# EAGLE design rf_blinky (EAGLE 5.11)

## Sheet 1 of 3
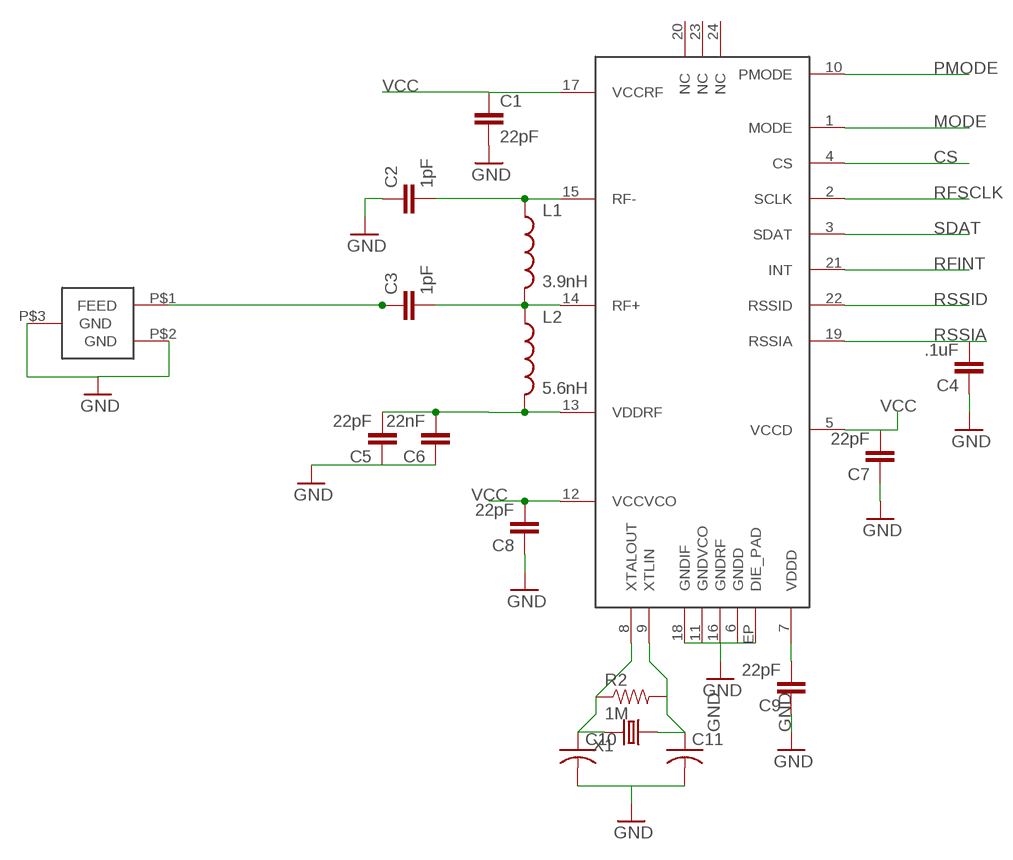
[diagram p0: schematic, sheet 1]

### Parts
ANT1  ANT_W3008  [W3008]
C1  22pF  CAP0603-CAP  [0603-CAP]
C2  1pF  CAP0603-CAP  [0603-CAP]
C3  1pF  CAP0603-CAP  [0603-CAP]
C4  .1uF  CAP0603-CAP  [0603-CAP]
C5  22pF  CAP0603-CAP  [0603-CAP]
C6  22nF  CAP0603-CAP  [0603-CAP]
C7  22pF  CAP0603-CAP  [0603-CAP]
C8  22pF  CAP0603-CAP  [0603-CAP]
C9  22pF  CAP0603-CAP  [0603-CAP]
C10  C-USC0805  [C0805]
C11  C-USC0805  [C0805]
IC3  TRC104  [QFN24]
L1  3.9nH  INDUCTOR0603  [0603]
L2  5.6nH  INDUCTOR0603  [0603]
R2  1M  RESISTOR0603-RES  [0603-RES]
X1  CRYSTAL-5032  [5032]

### Nets
ANT: ANT1.P$1(FEED) C3.1
CS: IC3.4(CS) ; also sheet 2
GND: ANT1.P$2(GND) ANT1.P$3(GND) C1.2 C2.1 C4.1 C5.1 C6.1 C7.1 C8.1 C9.1 C10.2 C11.2 IC3.6(GNDD) IC3.11(GNDVCO) IC3.16(GNDRF) IC3.18(GNDIF) IC3.EP(DIE_PAD) ; also sheet 2
MODE: IC3.1(MODE) ; also sheet 2
N$1: C5.2 C6.2 IC3.13(VDDRF) L2.2
N$2: C9.2 IC3.7(VDDD)
N$3: C3.2 IC3.14(RF+) L1.2 L2.1
N$4: C2.2 IC3.15(RF-) L1.1
N$7: C10.1 IC3.8(XTALOUT) R2.1 X1.2
N$8: C11.1 IC3.9(XTLIN) R2.2 X1.1
PMODE: IC3.10(PMODE) ; also sheet 2
RFINT: IC3.21(INT) ; also sheet 2
RFSCLK: IC3.2(SCLK) ; also sheet 2
RSSIA: C4.2 IC3.19(RSSIA) ; also sheet 2
RSSID: IC3.22(RSSID) ; also sheet 2
SDAT: IC3.3(SDAT) ; also sheet 2
VCC: C1.1 C7.2 C8.2 IC3.5(VCCD) IC3.12(VCCVCO) IC3.17(VCCRF) ; also sheet 2,3
Unconnected: IC3.20(NC) IC3.23(NC) IC3.24(NC)

## Sheet 2 of 3
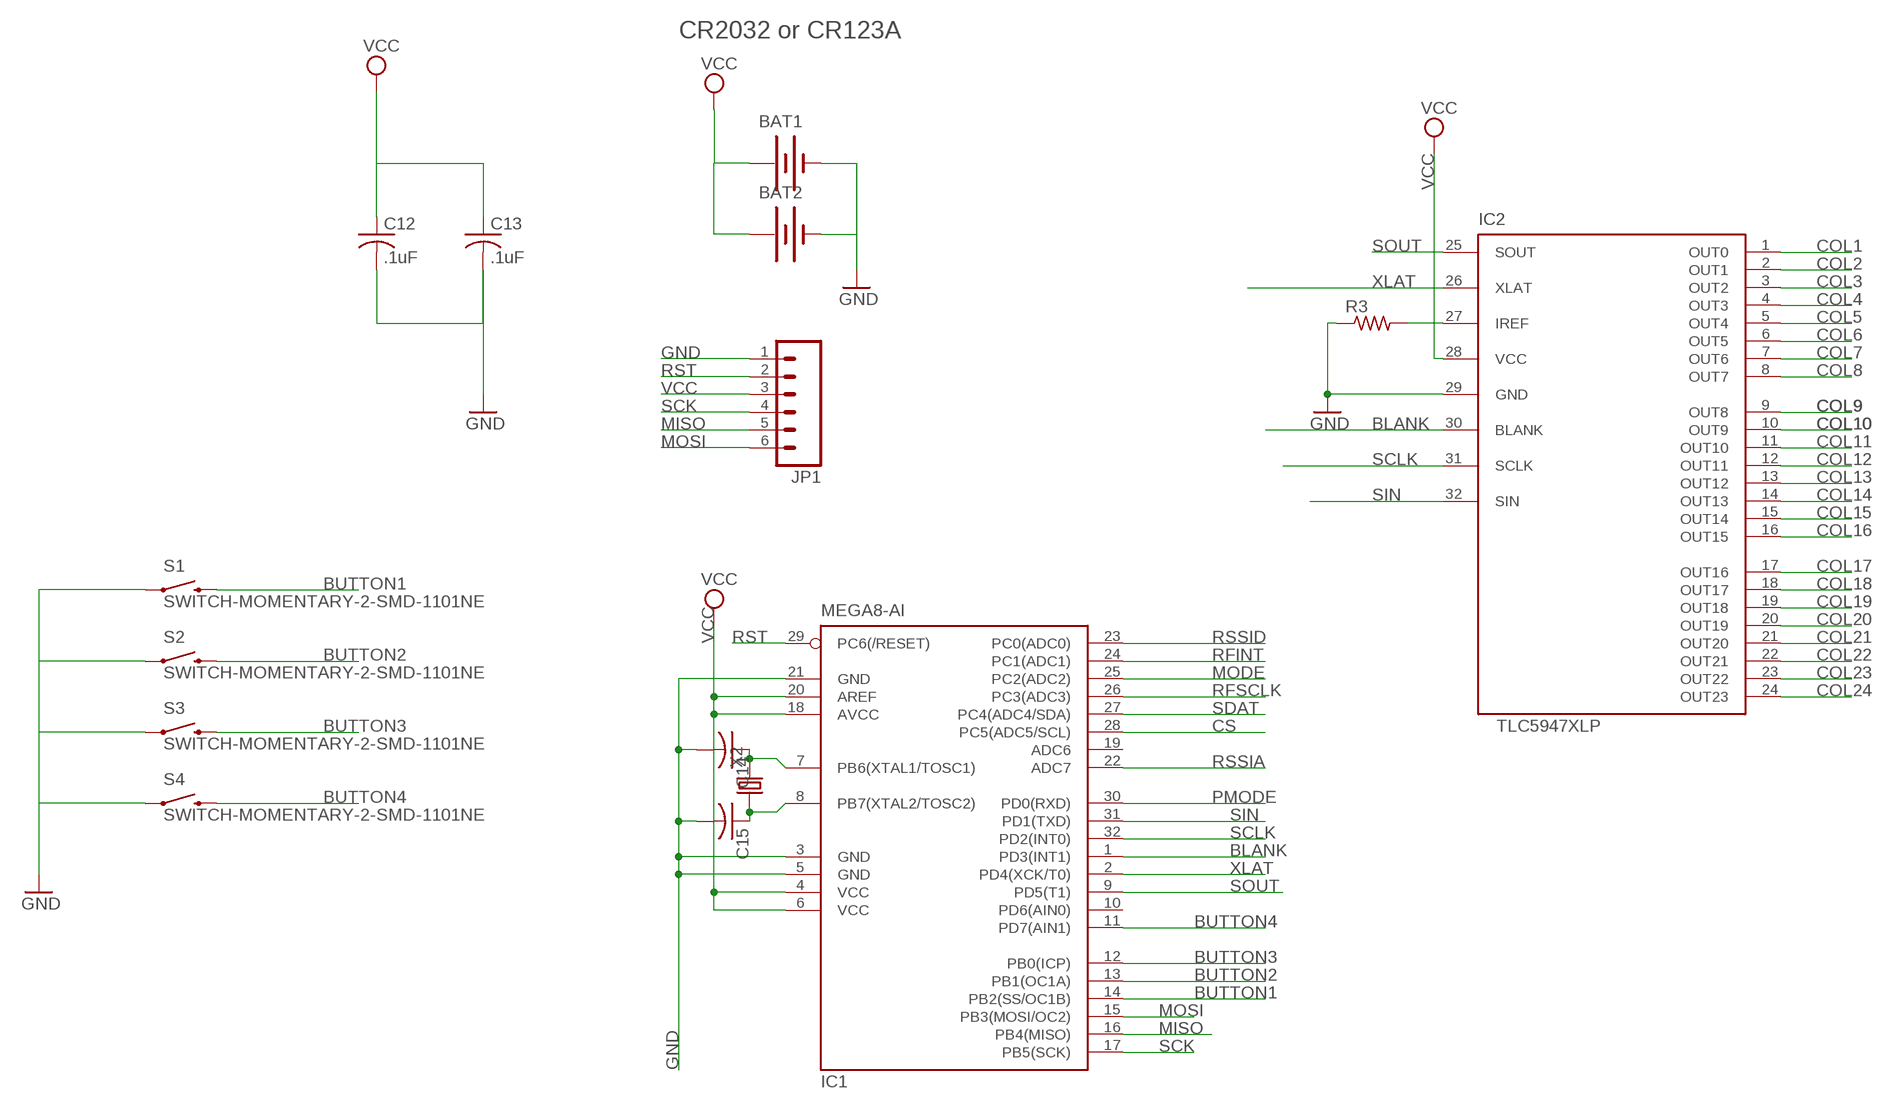
[diagram p1: schematic, sheet 2]

### Parts
BAT1  BATTERY20SMD  [BATTCON_20MM]
BAT2  BATTERYCR123A  [BATTERY_CR123A]
C12  .1uF  C-USC0805  [C0805]
C13  .1uF  C-USC0805  [C0805]
C14  C-USC0805  [C0805]
C15  C-USC0805  [C0805]
IC1  MEGA8-AI  [TQFP32-08]
IC2  TLC5947XLP  [QFN32_XLP]
JP1  M06SMD-FEMALE-V2  [1X06-SMD-FEMALE-V2]
R3  R-US_R1206  [R1206]
S1  SWITCH-MOMENTARY-2-SMD-1101NE  [TACTILE-SWITCH-1101NE]
S2  SWITCH-MOMENTARY-2-SMD-1101NE  [TACTILE-SWITCH-1101NE]
S3  SWITCH-MOMENTARY-2-SMD-1101NE  [TACTILE-SWITCH-1101NE]
S4  SWITCH-MOMENTARY-2-SMD-1101NE  [TACTILE-SWITCH-1101NE]
X2  CRYSTAL-5032  [5032]

### Nets
BLANK: IC1.1(PD3(INT1)) IC2.30(BLANK)
BUTTON1: IC1.14(PB2(SS/OC1B)) S1.P$2
BUTTON2: IC1.13(PB1(OC1A)) S2.P$2
BUTTON3: IC1.12(PB0(ICP)) S3.P$2
BUTTON4: IC1.11(PD7(AIN1)) S4.P$2
COL1: IC2.1(OUT0) ; also sheet 3
COL2: IC2.2(OUT1) ; also sheet 3
COL3: IC2.3(OUT2) ; also sheet 3
COL4: IC2.4(OUT3) ; also sheet 3
COL5: IC2.5(OUT4) ; also sheet 3
COL6: IC2.6(OUT5) ; also sheet 3
COL7: IC2.7(OUT6) ; also sheet 3
COL8: IC2.8(OUT7) ; also sheet 3
COL9: IC2.9(OUT8) ; also sheet 3
COL10: IC2.10(OUT9) ; also sheet 3
COL11: IC2.11(OUT10) ; also sheet 3
COL12: IC2.12(OUT11) ; also sheet 3
COL13: IC2.13(OUT12) ; also sheet 3
COL14: IC2.14(OUT13) ; also sheet 3
COL15: IC2.15(OUT14) ; also sheet 3
COL16: IC2.16(OUT15) ; also sheet 3
COL17: IC2.17(OUT16) ; also sheet 3
COL18: IC2.18(OUT17) ; also sheet 3
COL19: IC2.19(OUT18) ; also sheet 3
COL20: IC2.20(OUT19) ; also sheet 3
COL21: IC2.21(OUT20) ; also sheet 3
COL22: IC2.22(OUT21) ; also sheet 3
COL23: IC2.23(OUT22) ; also sheet 3
COL24: IC2.24(OUT23) ; also sheet 3
CS: IC1.28(PC5(ADC5/SCL)) ; also sheet 1
GND: BAT1.2(-) BAT2.- C12.2 C13.2 C14.2 C15.2 IC1.3(GND) IC1.5(GND) IC1.21(GND) IC2.29(GND) JP1.1 R3.1 S1.P$1 S2.P$1 S3.P$1 S4.P$1 ; also sheet 1
MISO: IC1.16(PB4(MISO)) JP1.5
MODE: IC1.25(PC2(ADC2)) ; also sheet 1
MOSI: IC1.15(PB3(MOSI/OC2)) JP1.6
N$5: C15.1 IC1.8(PB7(XTAL2/TOSC2)) X2.1
N$6: C14.1 IC1.7(PB6(XTAL1/TOSC1)) X2.2
N$13: IC2.27(IREF) R3.2
PMODE: IC1.30(PD0(RXD)) ; also sheet 1
RFINT: IC1.24(PC1(ADC1)) ; also sheet 1
RFSCLK: IC1.26(PC3(ADC3)) ; also sheet 1
RSSIA: IC1.22(ADC7) ; also sheet 1
RSSID: IC1.23(PC0(ADC0)) ; also sheet 1
RST: IC1.29(PC6(/RESET)) JP1.2
SCK: IC1.17(PB5(SCK)) JP1.4
SCLK: IC1.32(PD2(INT0)) IC2.31(SCLK)
SDAT: IC1.27(PC4(ADC4/SDA)) ; also sheet 1
SIN: IC1.31(PD1(TXD)) IC2.32(SIN)
SOUT: IC1.9(PD5(T1)) IC2.25(SOUT)
VCC: BAT1.1(+) BAT2.+ C12.1 C13.1 IC1.4(VCC) IC1.6(VCC) IC1.18(AVCC) IC1.20(AREF) IC2.28(VCC) JP1.3 ; also sheet 1,3
XLAT: IC1.2(PD4(XCK/T0)) IC2.26(XLAT)
Unconnected: IC1.10(PD6(AIN0)) IC1.19(ADC6)

### Notes on the sheet
- CR2032 or CR123A

## Sheet 3 of 3
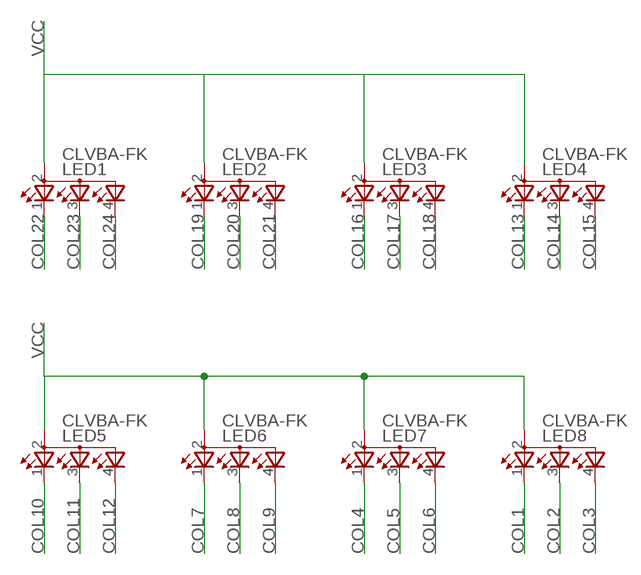
[diagram p2: schematic, sheet 3]

### Parts
LED1  CLVBA-FK  [PLCC4]
LED2  CLVBA-FK  [PLCC4]
LED3  CLVBA-FK  [PLCC4]
LED4  CLVBA-FK  [PLCC4]
LED5  CLVBA-FK  [PLCC4]
LED6  CLVBA-FK  [PLCC4]
LED7  CLVBA-FK  [PLCC4]
LED8  CLVBA-FK  [PLCC4]

### Nets
COL1: LED8.1(CRED) ; also sheet 2
COL2: LED8.3(CBLUE) ; also sheet 2
COL3: LED8.4(CGREEN) ; also sheet 2
COL4: LED7.1(CRED) ; also sheet 2
COL5: LED7.3(CBLUE) ; also sheet 2
COL6: LED7.4(CGREEN) ; also sheet 2
COL7: LED6.1(CRED) ; also sheet 2
COL8: LED6.3(CBLUE) ; also sheet 2
COL9: LED6.4(CGREEN) ; also sheet 2
COL10: LED5.1(CRED) ; also sheet 2
COL11: LED5.3(CBLUE) ; also sheet 2
COL12: LED5.4(CGREEN) ; also sheet 2
COL13: LED4.1(CRED) ; also sheet 2
COL14: LED4.3(CBLUE) ; also sheet 2
COL15: LED4.4(CGREEN) ; also sheet 2
COL16: LED3.1(CRED) ; also sheet 2
COL17: LED3.3(CBLUE) ; also sheet 2
COL18: LED3.4(CGREEN) ; also sheet 2
COL19: LED2.1(CRED) ; also sheet 2
COL20: LED2.3(CBLUE) ; also sheet 2
COL21: LED2.4(CGREEN) ; also sheet 2
COL22: LED1.1(CRED) ; also sheet 2
COL23: LED1.3(CBLUE) ; also sheet 2
COL24: LED1.4(CGREEN) ; also sheet 2
VCC: LED1.2(A2) LED2.2(A2) LED3.2(A2) LED4.2(A2) LED5.2(A2) LED6.2(A2) LED7.2(A2) LED8.2(A2) ; also sheet 1,2

## Library data of the parts
ANT1 = rf_blinky:ANT_W3008
BAT1 = SparkFun:BATTERY: Battery Holders Various common sizes : AA, AAA, 20mm coin cell and 12mm coin cell.
BAT2 = 8x8:BATTERY: Battery Holders Various common sizes : AA, AAA, 20mm coin cell and 12mm coin cell.
C1-C9 = SparkFun:CAP: Capacitor Standard 0603 ceramic capacitor, and 0.1" leaded capacitor.
C10-C15 = rcl:C-US: CAPACITOR, American symbol
IC1 = atmel:MEGA8: MICROCONTROLLER 8 Kbytes FLASH, 1 kbytes SRAM, 512 bytes EEPROM, USART, 6-channel 10 bit ADC, 2-channel 8 bit ADC Pin compatible with Atmega48, ATMega88, ATMega168 Source: avr.lbr; MPN: ATMEGA8-16AU; OC_FARNELL: 9171371; OC_NEWARK: 73M8863
IC2 = slice_noshift:TLC5947
IC3 = rf_blinky:TRC104
JP1 = 8x8:M06
L1 L2 = SparkFun:INDUCTOR: Inductors Basic Inductor/Choke - 0603 and 1206. Footprints are not proven and vary greatly between part numbers.
LED1-LED8 = rf_blinky:CLVBA-FK
R2 = SparkFun:RESISTOR: Resistor Basic schematic elements and footprints for 0603, 1206, and PTH resistors.
R3 = rcl:R-US_: RESISTOR, American symbol
S1-S4 = CPLD_Class:SWITCH-MOMENTARY-2
X1 X2 = NSL_MiniQuad:CRYSTAL*: CRYSTAL

## Board
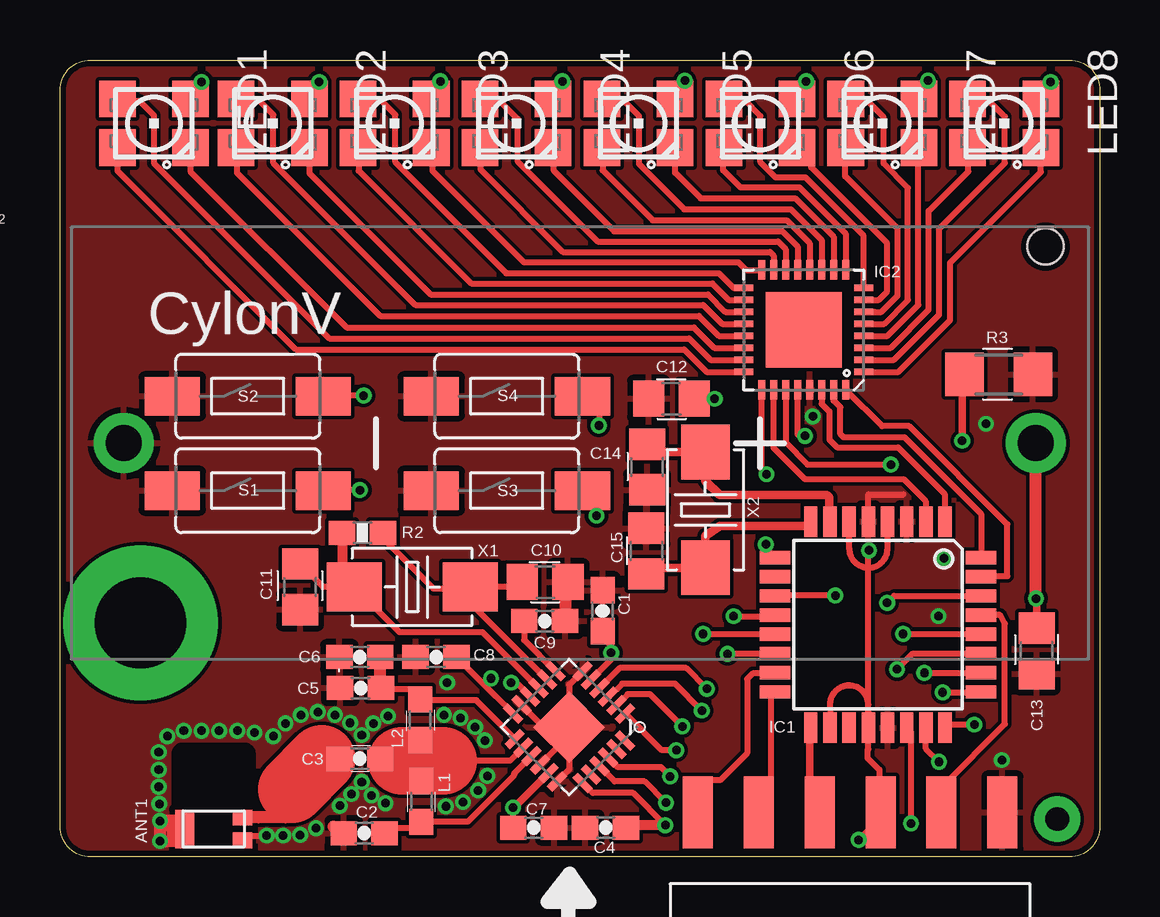
[diagram p3: board, top side]
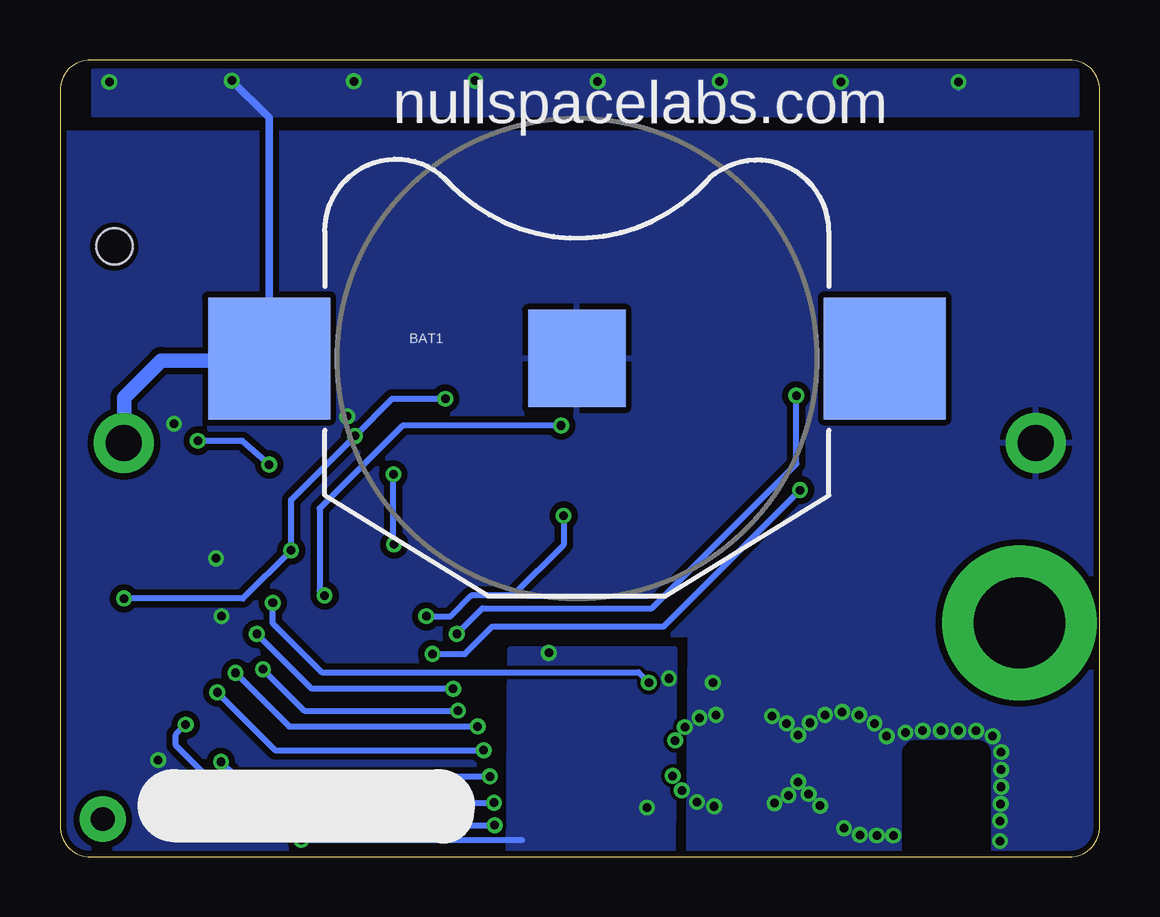
[diagram p4: board, bottom side, seen from below]

Size 43.33 x 33.22 mm. Coordinates in mm from the lower left corner, seen from the top.
Outline: 42.06,33.22 arc-90 43.33,31.95 43.33,1.27 arc-90 42.06,0 1.27,0 arc-90 0,1.27 0,31.95 arc-90 1.27,33.22 42.06,33.22
Copper layers (1*16): Top 0.035mm / dielectric 1.5mm / Bottom 0.035mm
Design rules "ITead_rule": minimum track width 6mil, minimum drill 12mil, track to track 6mil, track to pad 6mil, pad to pad 6mil, via to via 6mil, smd to smd 0mil, copper to edge 10mil, drill to drill 10mil, minimum pad ring 10mil, minimum via ring 6mil, stop-mask expansion 2mil, vias tented up to drill 100mil, thermal gap 10mil

### Footprints (pad centres in the part's own frame; a part is rotated, then mirrored left to right if it is on the bottom)
W3008 = smd 0.8 x 0.65: P$1 1.2,0.475; P$2 1.2,-0.475 | smd 0.8 x 1.6: P$3 -1.2,0
BATTCON_20MM = smd 5.08 x 5.08: 1 -12.827,0; 3 12.827,0 | smd 4.064 x 4.064: 2 0,0
BATTERY_CR123A = drill 1.5 pad 2.5 round: + 19,0; - -19,0 | hole 1.5: 19.4,8.2
0603-CAP = smd 1.1 x 1: 1 -0.85,0; 2 0.85,0
C0805 = smd 1.3 x 1.5: 1 -0.95,0; 2 0.95,0
TQFP32-08 = smd 1.27 x 0.559: 1 -4.293,2.8; 2 -4.293,2; 3 -4.293,1.2; 4 -4.293,0.4; 5 -4.293,-0.4; 6 -4.293,-1.2; 7 -4.293,-2; 8 -4.293,-2.8; 17 4.293,-2.8; 18 4.293,-2; 19 4.293,-1.2; 20 4.293,-0.4; 21 4.293,0.4; 22 4.293,1.2; 23 4.293,2; 24 4.293,2.8 | smd 0.559 x 1.27: 9 -2.8,-4.293; 10 -2,-4.293; 11 -1.2,-4.293; 12 -0.4,-4.293; 13 0.4,-4.293; 14 1.2,-4.293; 15 2,-4.293; 16 2.8,-4.293; 25 2.8,4.293; 26 2,4.293; 27 1.2,4.293; 28 0.4,4.293; 29 -0.4,4.293; 30 -1.2,4.293; 31 -2,4.293; 32 -2.8,4.293
QFN32_XLP = smd 0.285 x 0.8: 1 -1.75,-2.5; 2 -1.25,-2.5; 3 -0.75,-2.5; 4 -0.25,-2.5; 5 0.25,-2.5; 6 0.75,-2.5; 7 1.25,-2.5; 8 1.75,-2.5; 17 1.75,2.5; 18 1.25,2.5; 19 0.75,2.5; 20 0.25,2.5; 21 -0.25,2.5; 22 -0.75,2.5; 23 -1.25,2.5; 24 -1.75,2.5 | smd 0.8 x 0.285: 9 2.5,-1.75; 10 2.5,-1.25; 11 2.5,-0.75; 12 2.5,-0.25; 13 2.5,0.25; 14 2.5,0.75; 15 2.5,1.25; 16 2.5,1.75; 25 -2.5,1.75; 26 -2.5,1.25; 27 -2.5,0.75; 28 -2.5,0.25; 29 -2.5,-0.25; 30 -2.5,-0.75; 31 -2.5,-1.25; 32 -2.5,-1.75 | smd 3.15 x 3.15: EP 0,0
QFN24 = smd 0.9 x 0.3: 1 -2.05,1.25; 2 -2.05,0.75; 3 -2.05,0.25; 4 -2.05,-0.25; 5 -2.05,-0.75; 6 -2.05,-1.25; 13 1.95,-1.25; 14 1.95,-0.75; 15 1.95,-0.25; 16 1.95,0.25; 17 1.95,0.75; 18 1.95,1.25 | smd 0.3 x 0.9: 7 -1.25,-2.05; 8 -0.75,-2.05; 9 -0.25,-2.05; 10 0.25,-2.05; 11 0.75,-2.05; 12 1.25,-2.05; 19 1.25,2.05; 20 0.75,2.05; 21 0.25,2.05; 22 -0.25,2.05; 23 -0.75,2.05; 24 -1.25,2.05 | smd 2.1 x 2.1: EP 0,0
1X06-SMD-FEMALE-V2 = smd 1.25 x 3: 1 6.35,3.425; 2 3.81,3.425; 3 1.27,3.425; 4 -1.27,3.425; 5 -3.81,3.425; 6 -6.35,3.425
0603 = smd 1.1 x 1: 1 -0.85,0; 2 0.85,0
PLCC4 = smd 1.524 x 1.524: 1 -1.524,1.016; 2 -1.524,-1.016; 3 1.524,-1.016; 4 1.524,1.016
0603-RES = smd 1.1 x 1: 1 -0.85,0; 2 0.85,0
R1206 = smd 1.6 x 1.803: 1 -1.422,0; 2 1.422,0
TACTILE-SWITCH-1101NE = smd 2.3 x 1.6: P$1 -3.15,0; P$2 3.15,0
5032 = smd 2.286 x 2.032: 1 -2.413,0; 2 2.413,0

### Placement (x,y rotation side)
ANT1  6.4,1.17 0 top
BAT1  21.79,20.78 0 bottom
BAT2  21.67,17.25 0 top
C1  22.61,10.26 90 top
C2  12.67,0.99 0 top
C3  12.5,4.09 0 top
C4  22.73,1.22 0 top
C5  12.52,7.04 0 top
C6  12.49,8.33 0 top
C7  19.74,1.22 180 top
C8  15.67,8.33 0 top
C9  20.19,9.83 180 top
C10  20.21,11.45 0 top
C11  10.01,11.26 270 top
C12  25.48,19.1 180 top
C13  40.69,8.59 270 top
C14  24.46,16.26 270 top
C15  24.43,12.75 90 top
IC1  34.08,9.68 270 top
IC2  30.99,21.97 90 top
IC3  21.21,5.41 225 top
JP1  32.92,-1.57 0 top
L1  15.06,2.31 90 top
L2  15.01,5.71 90 top
LED1  3.91,30.58 180 top
LED2  8.86,30.58 180 top
LED3  13.94,30.58 180 top
LED4  19.02,30.58 180 top
LED5  24.1,30.58 180 top
LED6  29.18,30.58 180 top
LED7  34.26,30.58 180 top
LED8  39.34,30.58 180 top
R2  12.6,13.51 180 top
R3  39.12,20.12 180 top
S1  7.82,15.27 0 top
S2  7.82,19.2 0 top
S3  18.62,15.27 0 top
S4  18.62,19.2 0 top
X1  14.68,11.25 0 top
X2  26.89,14.47 90 top

### Tracks (layer width: path | path; a pad name or v marks a point on that pad's centre or on a via)
ANT
  Top 0.254: 8.89,1.65 8.41,1.65 8.28,1.52 9.4,1.52 9.73,1.85 9.73,2.57 9.65,2.82
  Top 0.508: C3.1 arc45 11.01,3.44 arc45 10.76,4.06 10.91,4.08 | ANT1.P$1 8.89,1.65
  Top 2.819: 10.91,4.08 9.65,2.82
ATTACHMENT  (via drill 3.81 pad 6.45)
  other vias: 3.35,9.75
BLANK
  Top 0.254: IC1.1 36.86,14 36.86,15.14 34.93,17.07 32.39,17.07 32.06,17.4 32.06,18.57 31.74,18.88 IC2.30
BUTTON1  (via drill 0.36)
  Top 0.254: 11.33,15.27 11.35,15.29 v12.5,15.29 | v27.81,8.46 27.84,8.48 IC1.14
  Top 0.406: 11.33,15.27 S1.P$2
  Bottom 0.254: v12.5,15.29 18.19,9.6 25.32,9.6 26.47,8.46 v27.81,8.46
BUTTON2  (via drill 0.36)
  Top 0.254: S2.P$2 11,19.23 v12.65,19.23 | v26.8,9.3 29.77,9.3 IC1.13
  Bottom 0.254: v12.65,19.23 12.65,16.38 18.67,10.36 25.73,10.36 v26.8,9.3
BUTTON3  (via drill 0.36)
  Top 0.254: S3.P$2 22.3,15.27 22.35,15.32 v22.35,14.22 | v28.07,10.03 29.74,10.03 IC1.12
  Bottom 0.254: v22.35,14.22 22.35,13 24.46,10.9 26.19,10.9 27.08,10.01 28.04,10.01 v28.07,10.03
BUTTON4  (via drill 0.36)
  Top 0.254: S4.P$2 22.33,19.2 22.48,19.05 22.48,18.01 v22.45,17.98 | v32.31,10.9 29.81,10.9 IC1.11
  Bottom 0.254: v22.45,17.98 29.06,17.98 32.51,14.53 32.51,11.1 v32.31,10.9
COL1
  Top 0.254: LED8.1 40.87,28.55 37.08,24.77 37.08,22.38 34.93,20.22 IC2.1
COL2
  Top 0.254: LED8.3 37.97,31.45 38.79,31.45 39.37,30.86 39.37,28.93 36.63,26.19 36.63,22.61 34.74,20.72 IC2.2
COL3
  Top 0.254: LED8.4 37.85,29.54 37.85,28.58 36.2,26.92 36.2,22.81 34.61,21.22 IC2.3
COL4
  Top 0.254: LED7.1 35.51,29.29 35.76,29.03 35.76,23.01 34.47,21.72 IC2.4
COL5
  Top 0.254: LED7.3 32.82,31.52 33.63,31.52 34.32,30.84 34.32,28.91 35.33,27.89 35.33,23.22 34.34,22.22 IC2.5
COL6
  Top 0.254: 33.95,22.72 IC2.6 34.23,22.72 34.9,23.39 34.9,26.19 32.72,28.37 32.72,29.54 LED7.4
COL7
  Top 0.254: LED6.1 31.29,28.98 31.29,28.75 34.47,25.58 34.47,23.57 34.12,23.22 IC2.7
COL8
  Top 0.254: LED6.3 27.71,31.55 28.52,31.55 29.18,30.89 29.18,28.96 29.82,28.32 31.06,28.32 33.49,25.9 IC2.8
COL9
  Top 0.254: IC2.9 32.74,25.99 30.81,27.91 28.35,27.91 27.64,28.63 27.64,29.54 LED6.4
COL10
  Top 0.254: IC2.10 32.24,25.85 30.63,27.46 26.7,27.46 25.63,28.52 LED5.1
COL11
  Top 0.254: IC2.11 31.74,25.72 30.45,27 26.01,27 24.13,28.88 24.13,30.89 23.52,31.5 22.68,31.5 LED5.3
COL12
  Top 0.254: IC2.12 31.24,25.58 30.28,26.54 24.69,26.54 22.61,28.63 22.61,29.54 LED5.4
COL13
  Top 0.254: IC2.13 30.74,25.45 30.1,26.09 23.09,26.09 20.57,28.6 20.57,29.54 LED4.1
COL14
  Top 0.254: IC2.14 30.24,25.34 29.92,25.65 22.4,25.65 19.08,28.98 19.08,30.76 18.36,31.47 17.63,31.47 LED4.3
COL15
  Top 0.254: IC2.15 29.74,25.08 29.59,25.22 20.96,25.22 17.53,28.65 17.53,29.54 LED4.4
COL16
  Top 0.254: LED3.1 15.52,29.51 15.52,28.6 19.33,24.79 28.27,24.79 28.59,24.47 IC2.16
COL17
  Top 0.254: IC2.17 28.07,23.72 27.46,24.33 18.59,24.33 13.97,28.96 13.97,30.94 13.39,31.52 12.5,31.52 LED3.3
COL18
  Top 0.254: IC2.18 27.86,23.22 27.18,23.9 17.15,23.9 12.45,28.6 12.45,29.54 LED3.4
COL19
  Top 0.254: IC2.19 27.72,22.72 27,23.44 15.44,23.44 10.39,28.5 LED2.1
COL20
  Top 0.254: IC2.20 27.59,22.22 26.8,23.01 14.81,23.01 8.89,28.93 8.89,30.94 8.26,31.57 7.37,31.57 LED2.3
COL21
  Top 0.254: IC2.21 27.45,21.72 26.62,22.56 13.34,22.56 7.37,28.52 7.37,29.54 LED2.4
COL22
  Top 0.254: IC2.22 27.27,21.22 26.42,22.07 11.94,22.07 5.44,28.58 LED1.1
COL23
  Top 0.254: IC2.23 27.11,20.72 26.21,21.62 11.23,21.62 3.91,28.93 3.91,30.91 3.3,31.52 2.46,31.52 LED1.3
COL24
  Top 0.254: IC2.24 26.95,20.22 26.01,21.16 9.83,21.16 2.39,28.6 LED1.4
CS  (via drill 0.36)
  Top 0.254: IC3.4 23.32,7.87 26.09,7.87 v26.95,7.01 | v35.13,9.3 38.36,9.3 IC1.28
  Bottom 0.254: v26.95,7.01 32.84,7.01 v35.13,9.3
GND  (via drill 0.36)
  Top 0.254: v8.61,0.89 7.8,0.89 ANT1.P$2 | IC3.16 20.84,4.69 21.21,5.06 IC3.EP 20.15,5.41 IC3.11 20.29,5.26 20.29,5.69 21.21,6.6 21.21,7.18 IC3.6 | IC1.5 33.68,15.11 35.15,15.11 | IC3.18 21.21,3.64 21.21,4.14
  Top 0.305: 21.21,4.14 20.84,4.51 20.84,4.69
  Top 0.508: v4.17,1.5 v4.17,0.66 | v4.17,0.66 4.42,0.64 | v4.17,0.66 5.08,0.64 5.2,0.76 ANT1.P$3 4.85,1.52 v4.17,1.5 | v4.17,1.5 4.7,1.19 4.7,0.94 4.93,1.17 5.18,1.17 | C2.1 11.4,1.27 | C10.2 21.04,11.33 C9.1
  other vias: 4.14,2.21 4.11,2.92 4.11,3.63 4.11,4.37 4.47,5.03 5.16,5.26 9.3,0.89 5.89,5.26 6.63,5.26 10.01,0.91 10.67,1.19 7.39,5.26 8.1,5.18 8.89,5.03 9.4,5.56 10.03,5.92 10.74,6.05 11.46,5.92 12.09,5.59 12.57,5.08 11.66,2.13 12.14,2.62 12.57,3.12 12.98,2.57 13.56,2.24 13.06,5.56 13.67,5.87 16.08,2.11 16.79,2.29 17.42,2.77 17.81,3.38 16,5.92 16.69,5.79 17.3,5.41 17.7,4.85 16.13,7.26 31.37,18.36 36.83,12.45 38.58,18.06 39.24,4.04 36.6,10.03
  pour Top (isolate 0.152): -1.32,35.1 43.99,35.1 43.99,-1.73 -1.32,-1.73
  pour Bottom (isolate 0.254): 44.17,-1.8 25.17,-1.78 25.17,9.27 17.07,9.3 17.14,-1.83 -1.27,-1.75 -1.35,30.15 44.09,30.15
MISO
  Top 0.254: IC1.16 29.62,6.71 29.62,2.95 29.11,2.44 JP1.5
MODE  (via drill 0.36)
  Top 0.254: IC3.1 25.07,4.45 v25.68,4.45 | v36.78,6.86 38.35,6.86 IC1.25
  Bottom 0.254: v25.68,4.45 34.37,4.45 v36.78,6.86
MOSI
  Top 0.254: IC1.15 29.75,7.65 28.85,7.65 28.63,7.42 28.63,4.32 27.51,3.2 26.64,3.2 26.57,3.12 JP1.6
N$1
  Top 0.254: IC3.13 18.95,4.93 17.35,6.53 15.05,6.53 L2.2 15.01,6.96 arc90 14.99,6.99 13.42,6.99 arc-90 C5.2
  Top 0.508: 13.34,8.36 C6.2 13.34,7.07 C5.2
N$2
  Top 0.254: IC3.7 19.34,9.04 C9.2
N$3
  Top 0.254: L1.2 15.77,3.81 15.98,4.01 18.75,4.01 IC3.14 | 14.25,4.01 14.17,4.09 C3.2
  Top 0.508: L1.2 L2.1
  Top 2.819: 15.98,4.01 14.25,4.01
N$4
  Top 0.254: IC3.15 18.92,3.48 18.92,3.4 16.99,1.47 L1.1 15,1.46 arc90 14.73,1.19 13.73,1.19 arc90 C2.2
N$5
  Top 0.356: C15.1 24.69,12.05 X2.1 26.89,13.38 27.48,13.79 31.28,13.79 IC1.8
N$6
  Top 0.356: C14.1 24.79,16.88 X2.2 26.89,15.68 27.48,15.09 31.95,15.09 32.06,14.99 32.06,14 IC1.7
N$7
  Top 0.254: C10.1 19.06,11.25 X1.2 | IC3.8 17.09,10.59 X1.2 | R2.1 13.45,13.29 15.57,11.18 17.01,11.18 X1.2
N$8
  Top 0.254: C11.1 10.96,11.25 X1.1 14.14,9.37 17.6,9.37 IC3.9
  Top 0.406: R2.2 11.75,11.25 X1.1 12.26,10.49
N$9  (via drill 0.99 pad 1.91)
  other vias: 41.55,1.57
N$13  (via drill 0.36)
  Top 0.254: IC2.27 30.25,19.66 30.25,17.25 31.14,16.36 v34.62,16.36 | v37.59,17.35 37.64,17.4
  Top 0.305: R3.2 37.59,20.01 v37.59,17.35
  Bottom 0.254: v34.62,16.36 35.74,17.35 v37.59,17.35
PMODE  (via drill 0.36)
  Top 0.254: IC3.10 19.58,6.71 19.1,7.19 v18.8,7.26 | v34.47,10.59 34.76,10.88 IC1.30
  Bottom 0.254: v34.47,10.59 34.47,9.73 32.44,7.7 19.23,7.7 v18.8,7.26
RFINT  (via drill 0.36)
  Top 0.254: IC3.21 23.11,3.15 24.36,3.15 v25.25,2.26 | v38.1,5.51 37.01,5.51 IC1.24
  Bottom 0.254: v25.25,2.26 36.12,2.26 38.51,4.65 38.51,5.11 v38.1,5.51
RFSCLK  (via drill 0.36)
  Top 0.254: IC3.2 23.65,6.78 24.59,6.78 v25.93,5.44 | v36.02,7.67 38.37,7.67 IC1.26
  Bottom 0.254: v25.93,5.44 33.78,5.44 v36.02,7.67
RSSIA  (via drill 0.36)
  Top 0.254: IC3.19 21.79,3.08 22.2,2.67 23.88,2.67 v25.22,1.32 | v35.46,1.4 35.46,5.21 IC1.22 | C4.2 23.57,1.22
  Top 0.406: v25.22,1.32 23.88,1.32 23.77,1.22 C4.2
  Bottom 0.254: v25.22,1.32 35.38,1.32 v35.46,1.4
RSSID  (via drill 0.36)
  Top 0.254: IC3.22 23.24,3.73 25.04,3.73 v25.43,3.35 | v36.63,3.96 36.08,4.51 IC1.23
  Bottom 0.254: v25.43,3.35 36.02,3.35 v36.63,3.96
RST
  Top 0.254: IC1.29 39.17,10.08 39.37,9.73 39.37,5.54 36.75,2.92 36.75,2.26 36.73,2.24 JP1.2
SCK
  Top 0.305: IC1.17 31.24,5.35 31.24,3.18 31.65,2.77 JP1.4
SCLK
  Top 0.254: IC2.31 32.23,19.02 32.51,18.75 32.51,17.63 32.64,17.5 35.18,17.5 38.38,14.3 IC1.32
SDAT  (via drill 0.36)
  Top 0.254: IC3.3 22.89,6.68 23.42,7.21 25.63,7.21 v26.75,6.1 | v34.87,7.82 35.53,8.48 IC1.27
  Bottom 0.254: v26.75,6.1 33.15,6.1 v34.87,7.82
SIN
  Top 0.254: IC1.31 38.4,11.71 39.47,11.71 39.47,13.87 35.38,17.96 34.25,17.96 IC2.32
SOUT  (via drill 0.36)
  Top 0.254: IC2.25 29.24,16.15 v29.44,15.95 | v29.41,13.03 29.46,12.81 IC1.9
  Bottom 0.254: v29.44,15.95 29.44,13.23 v29.41,13.03
VCC  (via drill 0.36)
  Top 0.254: IC1.4 34.48,12.86 arc-88 33.68,12.04 | IC1.6 32.89,13.96 32.89,12.85 arc88 33.68,12.04 | 33.68,6.35 arc0 IC1.20 33.68,4.5 33.66,4.47 33.66,4.11 34.14,3.63 34.14,1.9 JP1.3 34.19,1.63 v33.27,0.71 | 33.68,6.35 arc183 32.08,6.3 arc-7 IC1.18 | 33.68,6.35 33.68,12.04 | IC2.28 30.73,19.67 30.73,17.63 30.81,17.55 v31.04,17.55 | v33.71,12.78 33.68,12.75 33.68,12.04 | v27.28,19.1 C12.1 | LED1.2 5.44,31.85 v5.89,32.31 | LED2.2 10.39,31.9 v10.8,32.31 | LED3.2 15.47,31.95 v15.85,32.33 | LED4.2 20.55,31.95 v20.93,32.33 | LED5.2 25.63,31.95 v26.04,32.36 | LED6.2 30.71,31.95 v31.09,32.33 | LED7.2 35.79,31.98 v36.17,32.36 | LED8.2 40.87,31.9 v41.28,32.31 | C7.2 18.87,1.68 v18.87,2.06 18.9,2.04 | IC3.5 22.96,8.23 v22.96,8.51 | C8.2 18.04,6.81 | 18.04,6.81 18.14,6.71 IC3.12 | v17.96,7.44 17.68,7.17 | 17.68,7.17 | 18.04,6.81 17.68,7.17 | C1.1 22.91,9.11
  Top 0.305: 40.64,10.8 v40.67,10.77 40.69,10.74 C13.1 | BAT2.+ | 22.91,9.11 v22.96,8.51 | v18.87,2.06 18.92,2.06 IC3.17
  Top 0.508: v40.67,10.77 BAT2.+
  Bottom 0.254: v27.28,19.1 29.49,19.1 v31.04,17.55 33.71,14.88 v33.71,12.78 35.71,10.77 v40.67,10.77 | v5.89,32.31 5.89,32.05 | v33.27,0.71 24.08,0.71
  Bottom 0.305: 36.93,20.7 36.93,20.78 BAT1.1 34.62,30.81 v36.17,32.36
  Bottom 0.61: 36.93,20.7 39.12,20.7 40.67,19.15 BAT2.+
  pour Bottom: 0.97,32.74 41.94,32.74 41.94,30.96 0.97,30.96
  pour Bottom: 24.56,8.66 17.73,8.66 17.81,0 24.64,0
XLAT
  Top 0.254: IC1.2 36.07,14.83 35.15,15.75 31.04,15.75 29.74,17.05 IC2.26

### Text on the board
tPlace: CylonV | C7, C4 flipped on first rev boards | ease of solder correction
bPlace: nullspacelabs.com